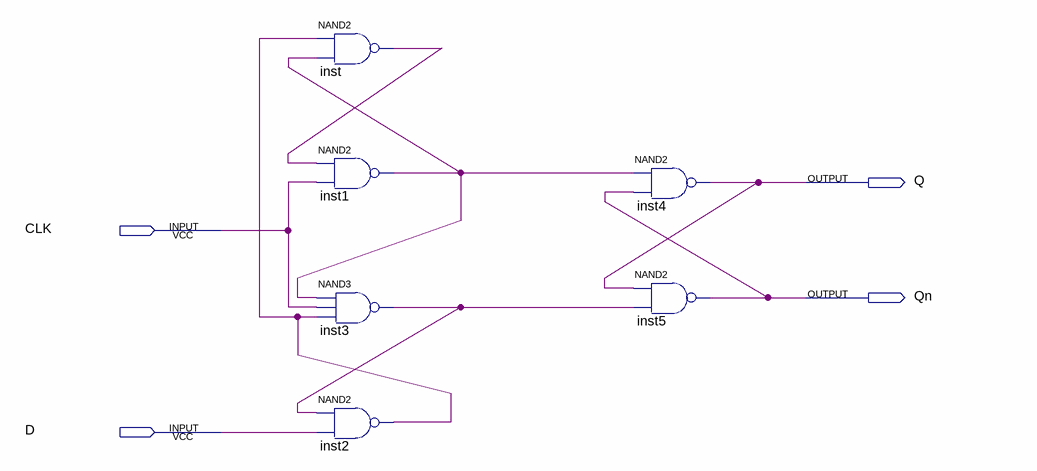
[diagram p0: schematic sheet]
// Quartus schematic FlipFlopD.bdf as structural Verilog: 6 symbols, 4 pins
module FlipFlopD (
  input  CLK,
  input  D,
  output Q,
  output Qn
);

  wire inst1_out, inst2_out, inst3_out, inst_out;

  nand inst (inst_out, inst2_out, inst1_out);
  nand inst1 (inst1_out, inst_out, CLK);
  nand inst3 (inst3_out, inst1_out, CLK, inst2_out);
  nand inst2 (inst2_out, inst3_out, D);
  nand inst4 (Q, inst1_out, Qn);
  nand inst5 (Qn, Q, inst3_out);
endmodule
